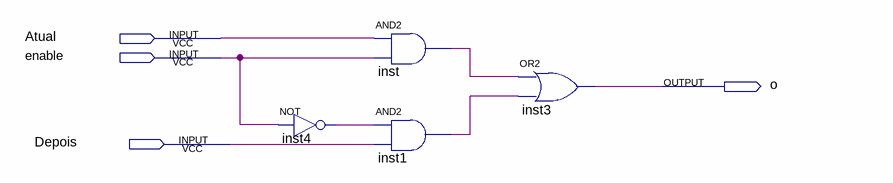
[diagram p0: schematic sheet]
// Quartus schematic moduloEnable.bdf as structural Verilog: 4 symbols, 4 pins
module moduloEnable (
  input  Atual,
  input  enable,
  input  Depois,
  output o
);

  wire inst1_out, inst4_out, inst_out;

  not inst4 (inst4_out, enable);
  and inst (inst_out, Atual, enable);
  and inst1 (inst1_out, inst4_out, Depois);
  or inst3 (o, inst_out, inst1_out);
endmodule
